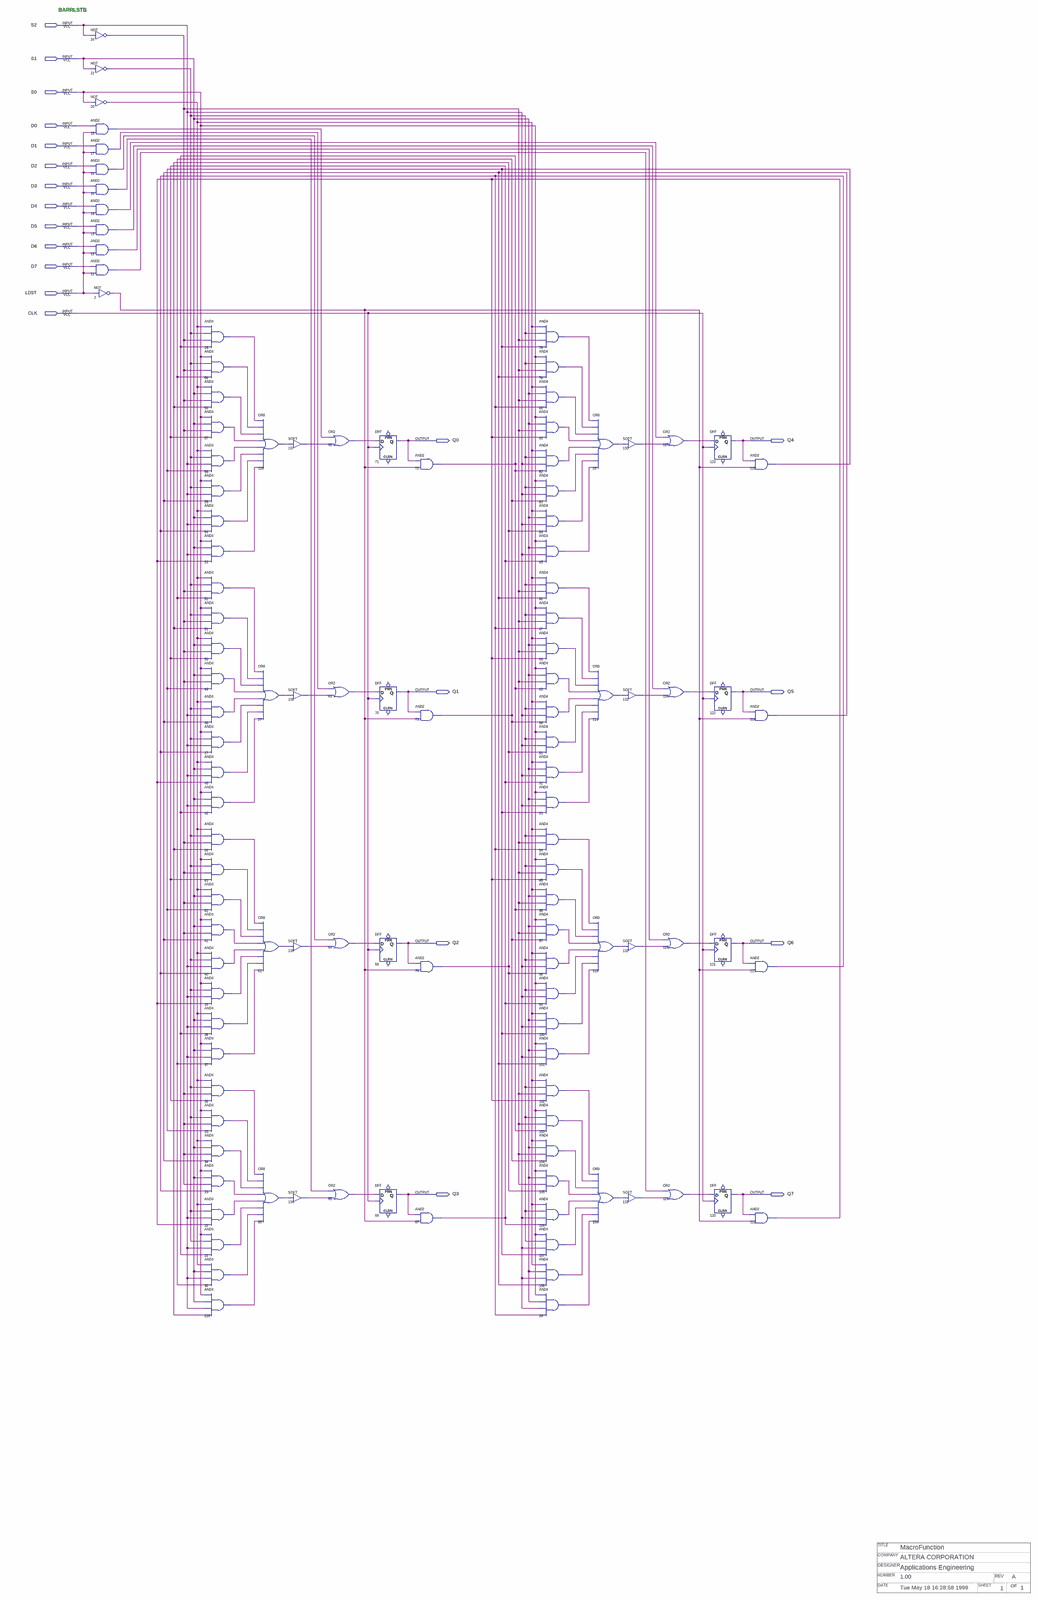
[diagram p0: schematic sheet, whole]
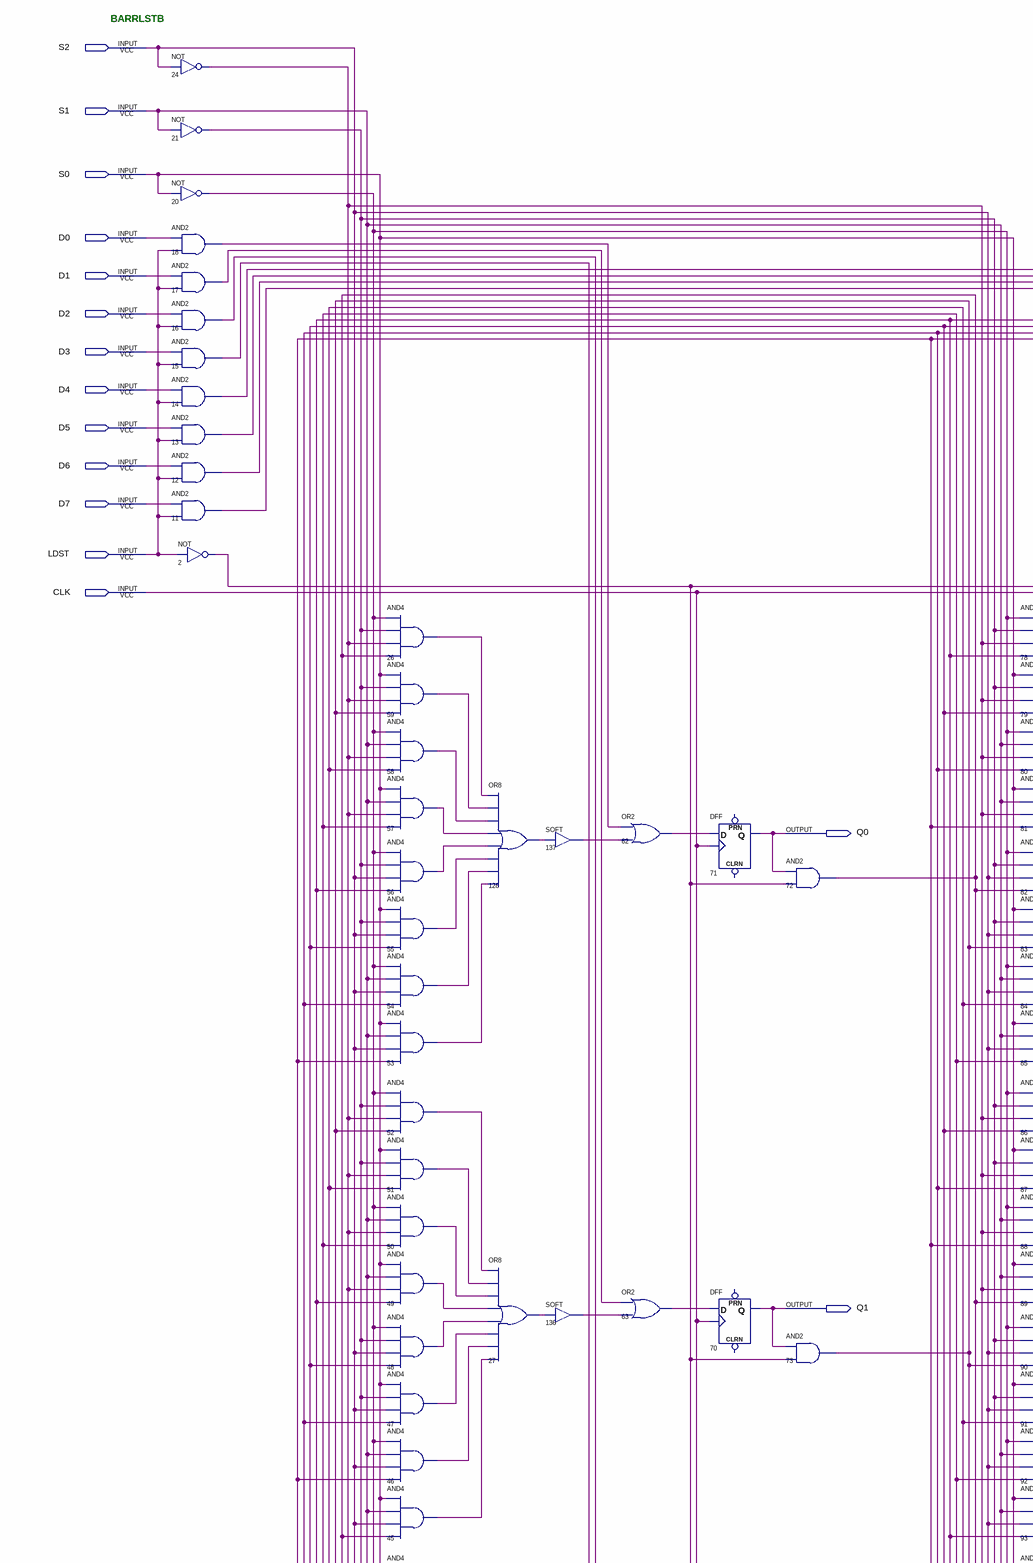
[diagram p1: schematic sheet, upper left part]
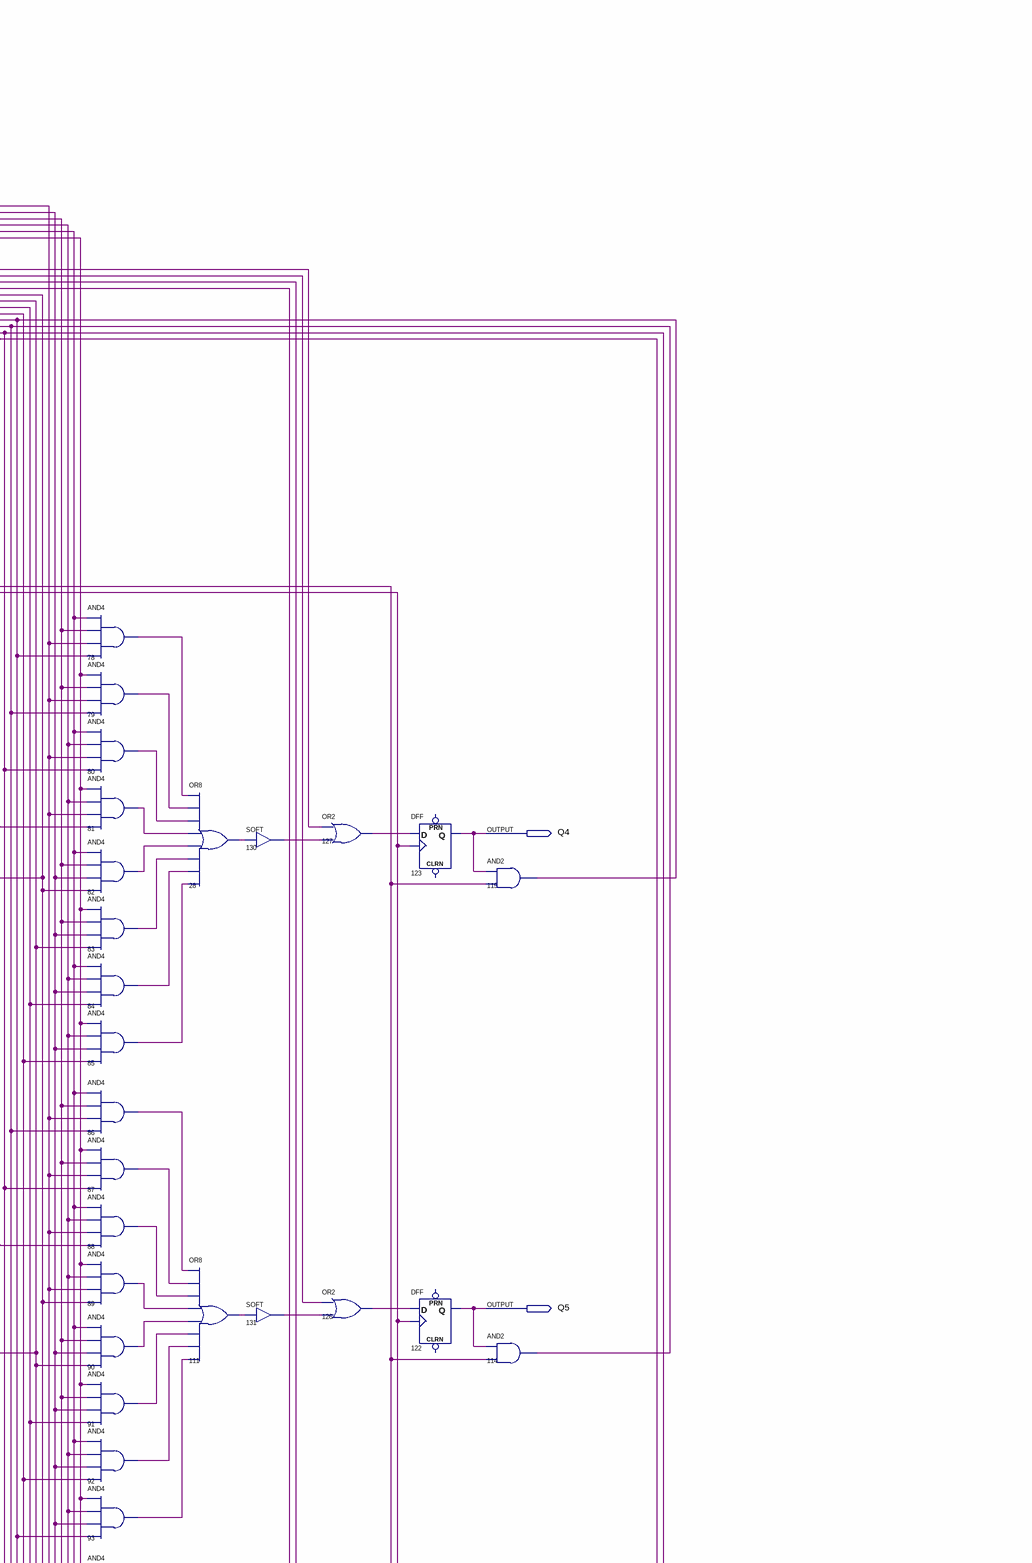
[diagram p2: schematic sheet, upper right part]
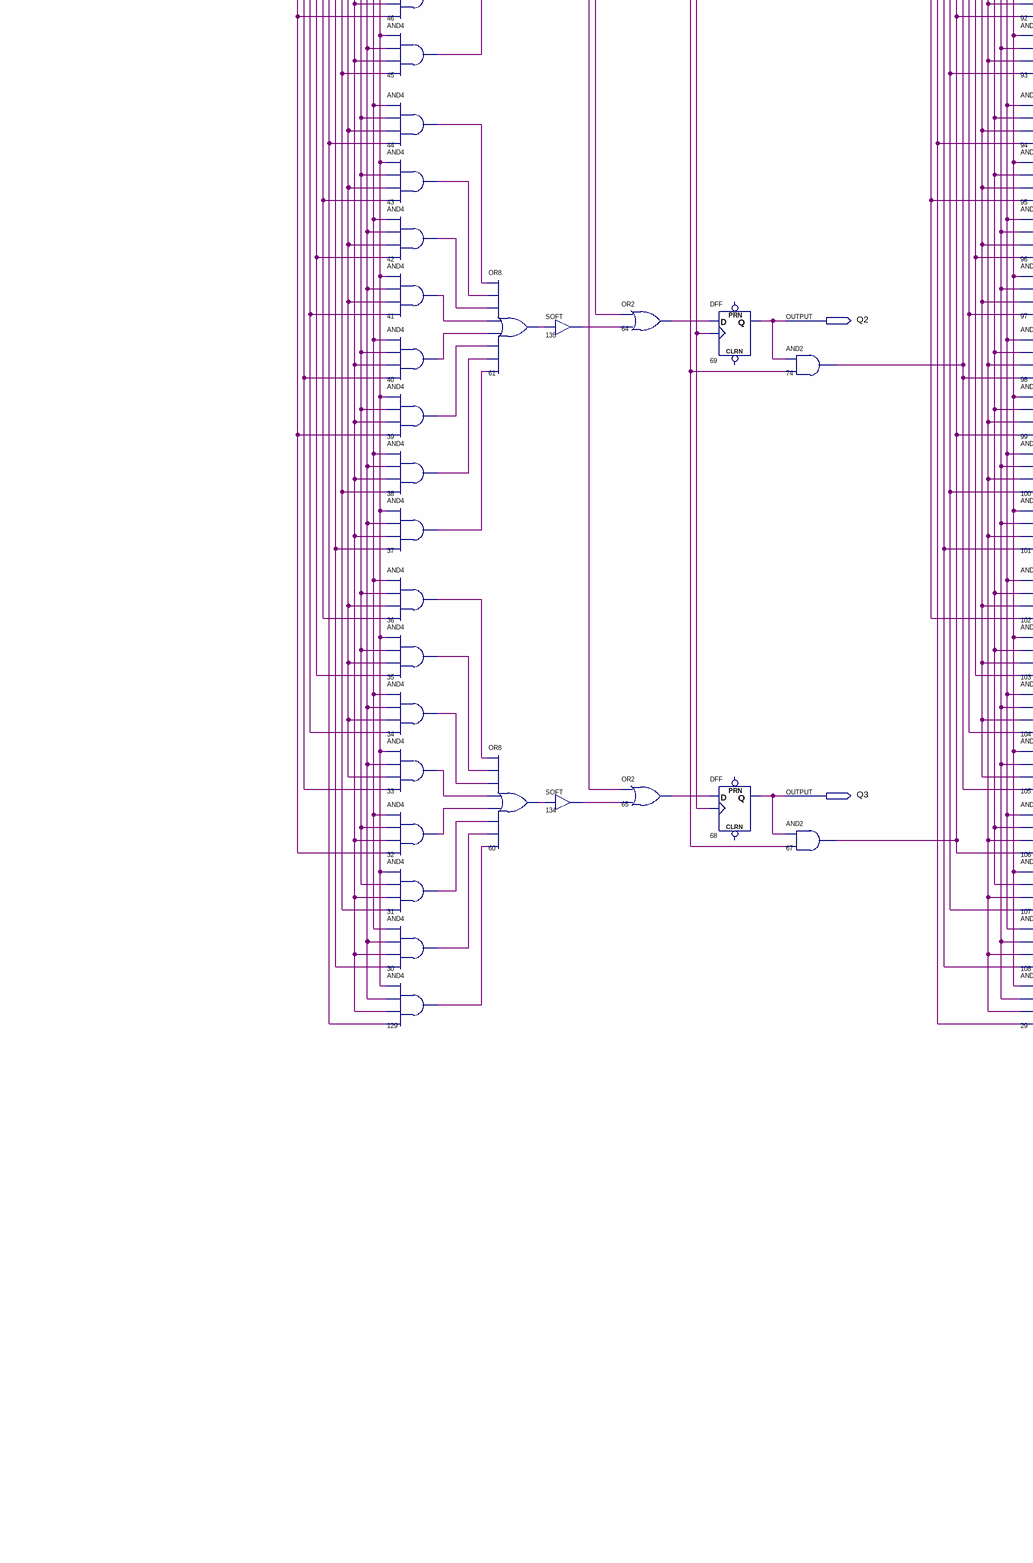
[diagram p3: schematic sheet, lower left part]
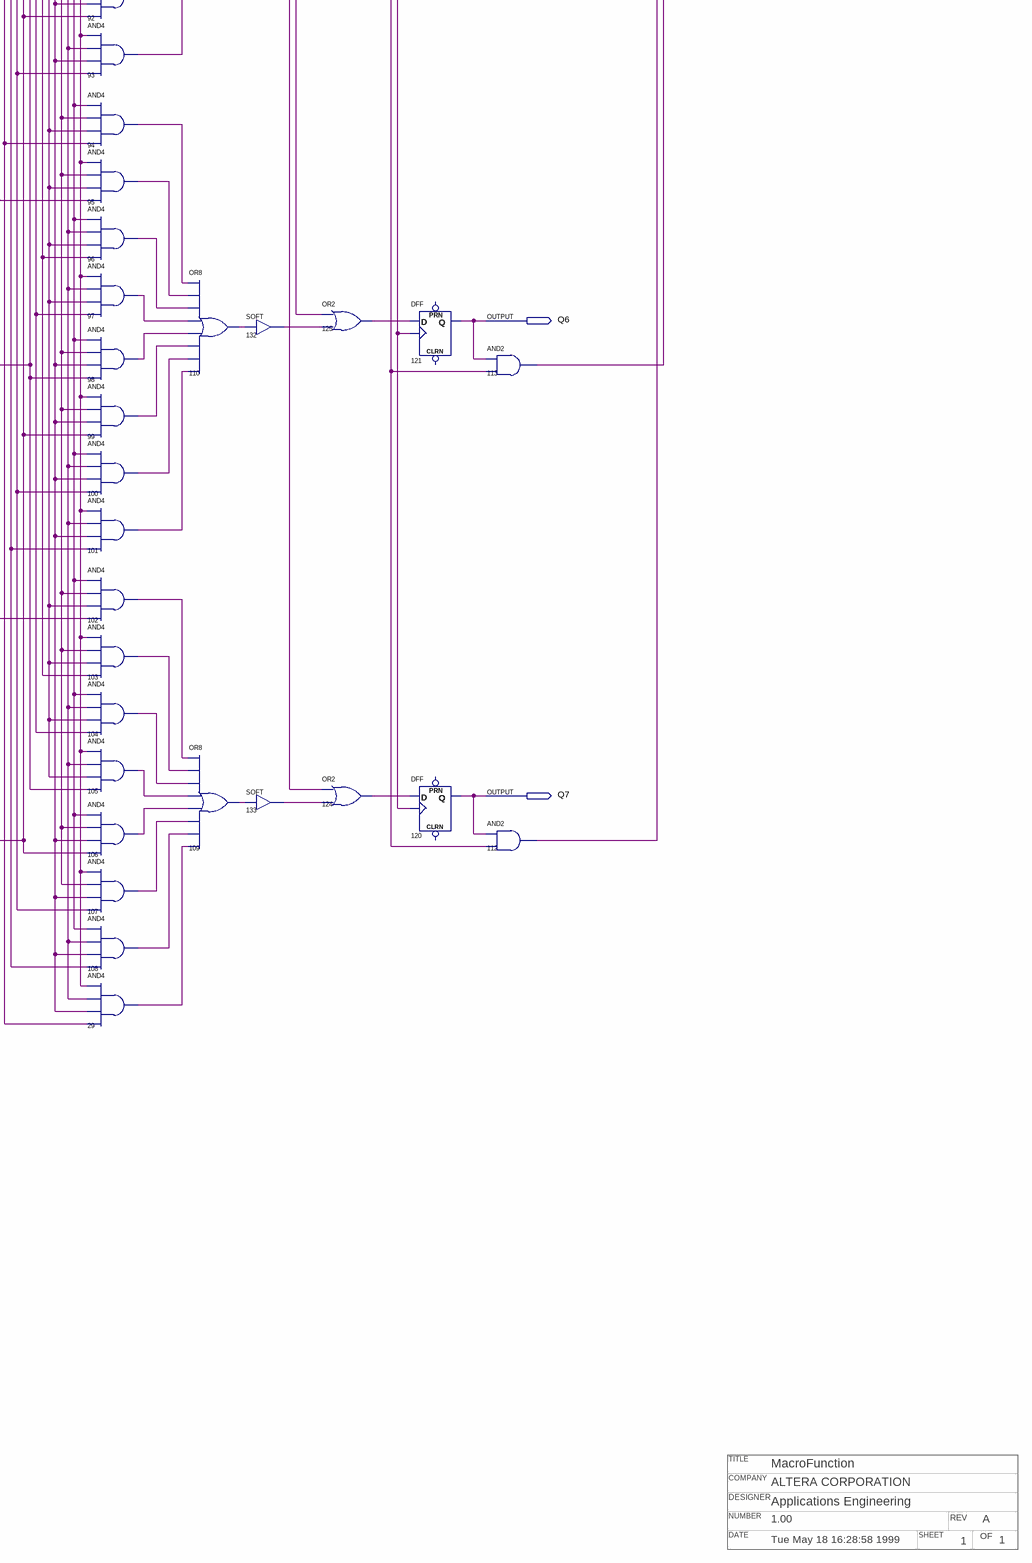
[diagram p4: schematic sheet, lower right part]
// Quartus schematic barrlstb.bdf as structural Verilog: 116 symbols, 21 pins
// Title block: TITLE: MacroFunction; COMPANY: ALTERA CORPORATION; DESIGNER: Applications Engineering; NUMBER: 1.00; REV: A; DATE: Tue May 18 16:28:58 1999; SHEET: 1; OF: 1
module barrlstb (
  input  S2,
  input  S1,
  input  S0,
  input  D0,
  input  D1,
  input  D2,
  input  D3,
  input  D4,
  input  D5,
  input  D6,
  input  D7,
  input  LDST,
  input  CLK,
  output Q0,
  output Q4,
  output Q1,
  output Q5,
  output Q2,
  output Q6,
  output Q3,
  output Q7
);

  wire n2_out, n11_out, n12_out, n13_out, n14_out, n15_out, n16_out, n17_out, n18_out, n20_out, n21_out,
       n24_out, n26_out, n27_out, n28_out, n29_out, n30_out, n31_out, n32_out, n33_out, n34_out, n35_out,
       n36_out, n37_out, n38_out, n39_out, n40_out, n41_out, n42_out, n43_out, n44_out, n45_out, n46_out,
       n47_out, n48_out, n49_out, n50_out, n51_out, n52_out, n53_out, n54_out, n55_out, n56_out, n57_out,
       n58_out, n59_out, n60_out, n61_out, n62_out, n63_out, n64_out, n65_out, n67_out, n72_out, n73_out,
       n74_out, n78_out, n79_out, n80_out, n81_out, n82_out, n83_out, n84_out, n85_out, n86_out, n87_out,
       n88_out, n89_out, n90_out, n91_out, n92_out, n93_out, n94_out, n95_out, n96_out, n97_out, n98_out,
       n99_out, n100_out, n101_out, n102_out, n103_out, n104_out, n105_out, n106_out, n107_out, n108_out,
       n109_out, n110_out, n111_out, n112_out, n113_out, n114_out, n115_out, n124_out, n125_out, n126_out,
       n127_out, n128_out, n129_out, n130_out, n131_out, n132_out, n133_out, n134_out, n135_out, n136_out,
       n137_out;

  not u_24 (n24_out, S2);
  not u_21 (n21_out, S1);
  not u_20 (n20_out, S0);
  and u_18 (n18_out, D0, LDST);
  and u_17 (n17_out, D1, LDST);
  and u_16 (n16_out, D2, LDST);
  and u_15 (n15_out, D3, LDST);
  and u_14 (n14_out, D4, LDST);
  and u_13 (n13_out, D5, LDST);
  and u_12 (n12_out, D6, LDST);
  and u_11 (n11_out, D7, LDST);
  not u_2 (n2_out, LDST);
  and u_26 (n26_out, n20_out, n21_out, n24_out, n72_out);
  and u_59 (n59_out, S0, n21_out, n24_out, n73_out);
  and u_58 (n58_out, n20_out, S1, n24_out, n74_out);
  and u_57 (n57_out, S0, S1, n24_out, n67_out);
  and u_56 (n56_out, n20_out, n21_out, S2, n115_out);
  and u_55 (n55_out, S0, n21_out, S2, n114_out);
  and u_54 (n54_out, n20_out, S1, S2, n113_out);
  and u_53 (n53_out, S0, S1, S2, n112_out);
  and u_52 (n52_out, n20_out, n21_out, n24_out, n73_out);
  and u_51 (n51_out, S0, n21_out, n24_out, n74_out);
  and u_50 (n50_out, n20_out, S1, n24_out, n67_out);
  and u_49 (n49_out, S0, S1, n24_out, n115_out);
  and u_48 (n48_out, n20_out, n21_out, S2, n114_out);
  and u_47 (n47_out, S0, n21_out, S2, n113_out);
  and u_46 (n46_out, n20_out, S1, S2, n112_out);
  and u_45 (n45_out, S0, S1, S2, n72_out);
  and u_44 (n44_out, n20_out, n21_out, n24_out, n74_out);
  and u_43 (n43_out, S0, n21_out, n24_out, n67_out);
  and u_42 (n42_out, n20_out, S1, n24_out, n115_out);
  and u_41 (n41_out, S0, S1, n24_out, n114_out);
  and u_40 (n40_out, n20_out, n21_out, S2, n113_out);
  and u_39 (n39_out, S0, n21_out, S2, n112_out);
  and u_38 (n38_out, n20_out, S1, S2, n72_out);
  and u_37 (n37_out, S0, S1, S2, n73_out);
  and u_36 (n36_out, n20_out, n21_out, n24_out, n67_out);
  and u_35 (n35_out, S0, n21_out, n24_out, n115_out);
  and u_34 (n34_out, n20_out, S1, n24_out, n114_out);
  and u_33 (n33_out, S0, S1, n24_out, n113_out);
  and u_32 (n32_out, n20_out, n21_out, S2, n112_out);
  and u_31 (n31_out, S0, n21_out, S2, n72_out);
  and u_30 (n30_out, n20_out, S1, S2, n73_out);
  and u_129 (n129_out, S0, S1, S2, n74_out);
  or u_128 (n128_out, n26_out, n59_out, n58_out, n57_out, n56_out, n55_out, n54_out, n53_out);
  or u_27 (n27_out, n52_out, n51_out, n50_out, n49_out, n48_out, n47_out, n46_out, n45_out);
  or u_61 (n61_out, n44_out, n43_out, n42_out, n41_out, n40_out, n39_out, n38_out, n37_out);
  or u_60 (n60_out, n36_out, n35_out, n34_out, n33_out, n32_out, n31_out, n30_out, n129_out);
  SOFT u_137 (.IN(n128_out), .OUT(n137_out));
  SOFT u_136 (.IN(n27_out), .OUT(n136_out));
  SOFT u_135 (.IN(n61_out), .OUT(n135_out));
  SOFT u_134 (.IN(n60_out), .OUT(n134_out));
  or u_62 (n62_out, n18_out, n137_out);
  or u_63 (n63_out, n17_out, n136_out);
  or u_64 (n64_out, n16_out, n135_out);
  or u_65 (n65_out, n15_out, n134_out);
  DFF u_71 (.CLK(CLK), .D(n62_out), .Q(Q0));  // open: CLRN, PRN
  DFF u_70 (.CLK(CLK), .D(n63_out), .Q(Q1));  // open: CLRN, PRN
  DFF u_69 (.CLK(CLK), .D(n64_out), .Q(Q2));  // open: CLRN, PRN
  DFF u_68 (.CLK(CLK), .D(n65_out), .Q(Q3));  // open: CLRN, PRN
  and u_72 (n72_out, Q0, n2_out);
  and u_73 (n73_out, Q1, n2_out);
  and u_74 (n74_out, Q2, n2_out);
  and u_67 (n67_out, Q3, n2_out);
  and u_78 (n78_out, n20_out, n21_out, n24_out, n115_out);
  and u_79 (n79_out, S0, n21_out, n24_out, n114_out);
  and u_80 (n80_out, n20_out, S1, n24_out, n113_out);
  and u_81 (n81_out, S0, S1, n24_out, n112_out);
  and u_82 (n82_out, n20_out, n21_out, S2, n72_out);
  and u_83 (n83_out, S0, n21_out, S2, n73_out);
  and u_84 (n84_out, n20_out, S1, S2, n74_out);
  and u_85 (n85_out, S0, S1, S2, n67_out);
  and u_86 (n86_out, n20_out, n21_out, n24_out, n114_out);
  and u_87 (n87_out, S0, n21_out, n24_out, n113_out);
  and u_88 (n88_out, n20_out, S1, n24_out, n112_out);
  and u_89 (n89_out, S0, S1, n24_out, n72_out);
  and u_90 (n90_out, n20_out, n21_out, S2, n73_out);
  and u_91 (n91_out, S0, n21_out, S2, n74_out);
  and u_92 (n92_out, n20_out, S1, S2, n67_out);
  and u_93 (n93_out, S0, S1, S2, n115_out);
  and u_94 (n94_out, n20_out, n21_out, n24_out, n113_out);
  and u_95 (n95_out, S0, n21_out, n24_out, n112_out);
  and u_96 (n96_out, n20_out, S1, n24_out, n72_out);
  and u_97 (n97_out, S0, S1, n24_out, n73_out);
  and u_98 (n98_out, n20_out, n21_out, S2, n74_out);
  and u_99 (n99_out, S0, n21_out, S2, n67_out);
  and u_100 (n100_out, n20_out, S1, S2, n115_out);
  and u_101 (n101_out, S0, S1, S2, n114_out);
  and u_102 (n102_out, n20_out, n21_out, n24_out, n112_out);
  and u_103 (n103_out, S0, n21_out, n24_out, n72_out);
  and u_104 (n104_out, n20_out, S1, n24_out, n73_out);
  and u_105 (n105_out, S0, S1, n24_out, n74_out);
  and u_106 (n106_out, n20_out, n21_out, S2, n67_out);
  and u_107 (n107_out, S0, n21_out, S2, n115_out);
  and u_108 (n108_out, n20_out, S1, S2, n114_out);
  and u_29 (n29_out, S0, S1, S2, n113_out);
  or u_28 (n28_out, n78_out, n79_out, n80_out, n81_out, n82_out, n83_out, n84_out, n85_out);
  or u_111 (n111_out, n86_out, n87_out, n88_out, n89_out, n90_out, n91_out, n92_out, n93_out);
  or u_110 (n110_out, n94_out, n95_out, n96_out, n97_out, n98_out, n99_out, n100_out, n101_out);
  or u_109 (n109_out, n102_out, n103_out, n104_out, n105_out, n106_out, n107_out, n108_out, n29_out);
  SOFT u_130 (.IN(n28_out), .OUT(n130_out));
  SOFT u_131 (.IN(n111_out), .OUT(n131_out));
  SOFT u_132 (.IN(n110_out), .OUT(n132_out));
  SOFT u_133 (.IN(n109_out), .OUT(n133_out));
  or u_127 (n127_out, n14_out, n130_out);
  or u_126 (n126_out, n13_out, n131_out);
  or u_125 (n125_out, n12_out, n132_out);
  or u_124 (n124_out, n11_out, n133_out);
  DFF u_123 (.CLK(CLK), .D(n127_out), .Q(Q4));  // open: CLRN, PRN
  DFF u_122 (.CLK(CLK), .D(n126_out), .Q(Q5));  // open: CLRN, PRN
  DFF u_121 (.CLK(CLK), .D(n125_out), .Q(Q6));  // open: CLRN, PRN
  DFF u_120 (.CLK(CLK), .D(n124_out), .Q(Q7));  // open: CLRN, PRN
  and u_115 (n115_out, Q4, n2_out);
  and u_114 (n114_out, Q5, n2_out);
  and u_113 (n113_out, Q6, n2_out);
  and u_112 (n112_out, Q7, n2_out);

  // Notes on the sheet:
  //   BARRLSTB
endmodule
